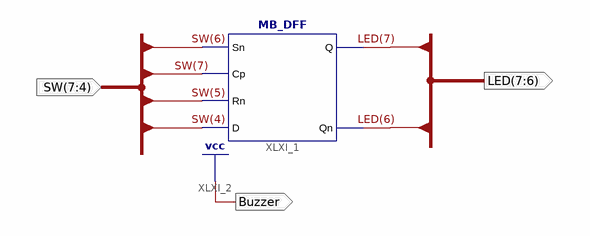
[diagram p0: schematic sheet 1]
// Xilinx ISE schematic Top_MB_DFF.sch (kintex7) as structural Verilog: 1 symbols, 3 ports
module Top_MB_DFF (
  input  [7:4] SW,
  output [7:6] LED,
  output Buzzer
);

  MB_DFF XLXI_1 (.Sn(SW[6]), .Cp(SW[7]), .Rn(SW[5]), .D(SW[4]), .Q(LED[7]), .Qn(LED[6]));

  assign Buzzer = 1'b1;
endmodule
